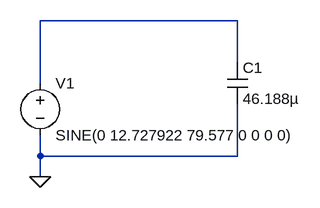
[diagram p0: schematic scheme2.asc]
scheme2.asc, the LTspice schematic file:
Version 4
SHEET 1 880 680
WIRE 464 32 160 32
WIRE 464 96 464 32
WIRE 160 128 160 32
WIRE 160 240 160 208
WIRE 464 240 464 160
WIRE 464 240 160 240
WIRE 160 272 160 240
FLAG 160 272 0
SYMBOL voltage 160 112 R0
WINDOW 123 0 0 Left 0
WINDOW 39 0 0 Left 0
SYMATTR InstName V1
SYMATTR Value SINE(0 12.727922 79.577 0 0 0 0)
SYMBOL cap 448 96 R0
SYMATTR InstName C1
SYMATTR Value 46.188µ

The netlist it stands for:
* scheme2.asc
V1 N001 0 SINE(0 12.727922 79.577 0 0 0 0)
C1 N001 0 46.188µ
.backanno
.end